# EAGLE design AdapterQFP48forZIF (EAGLE 6.3)
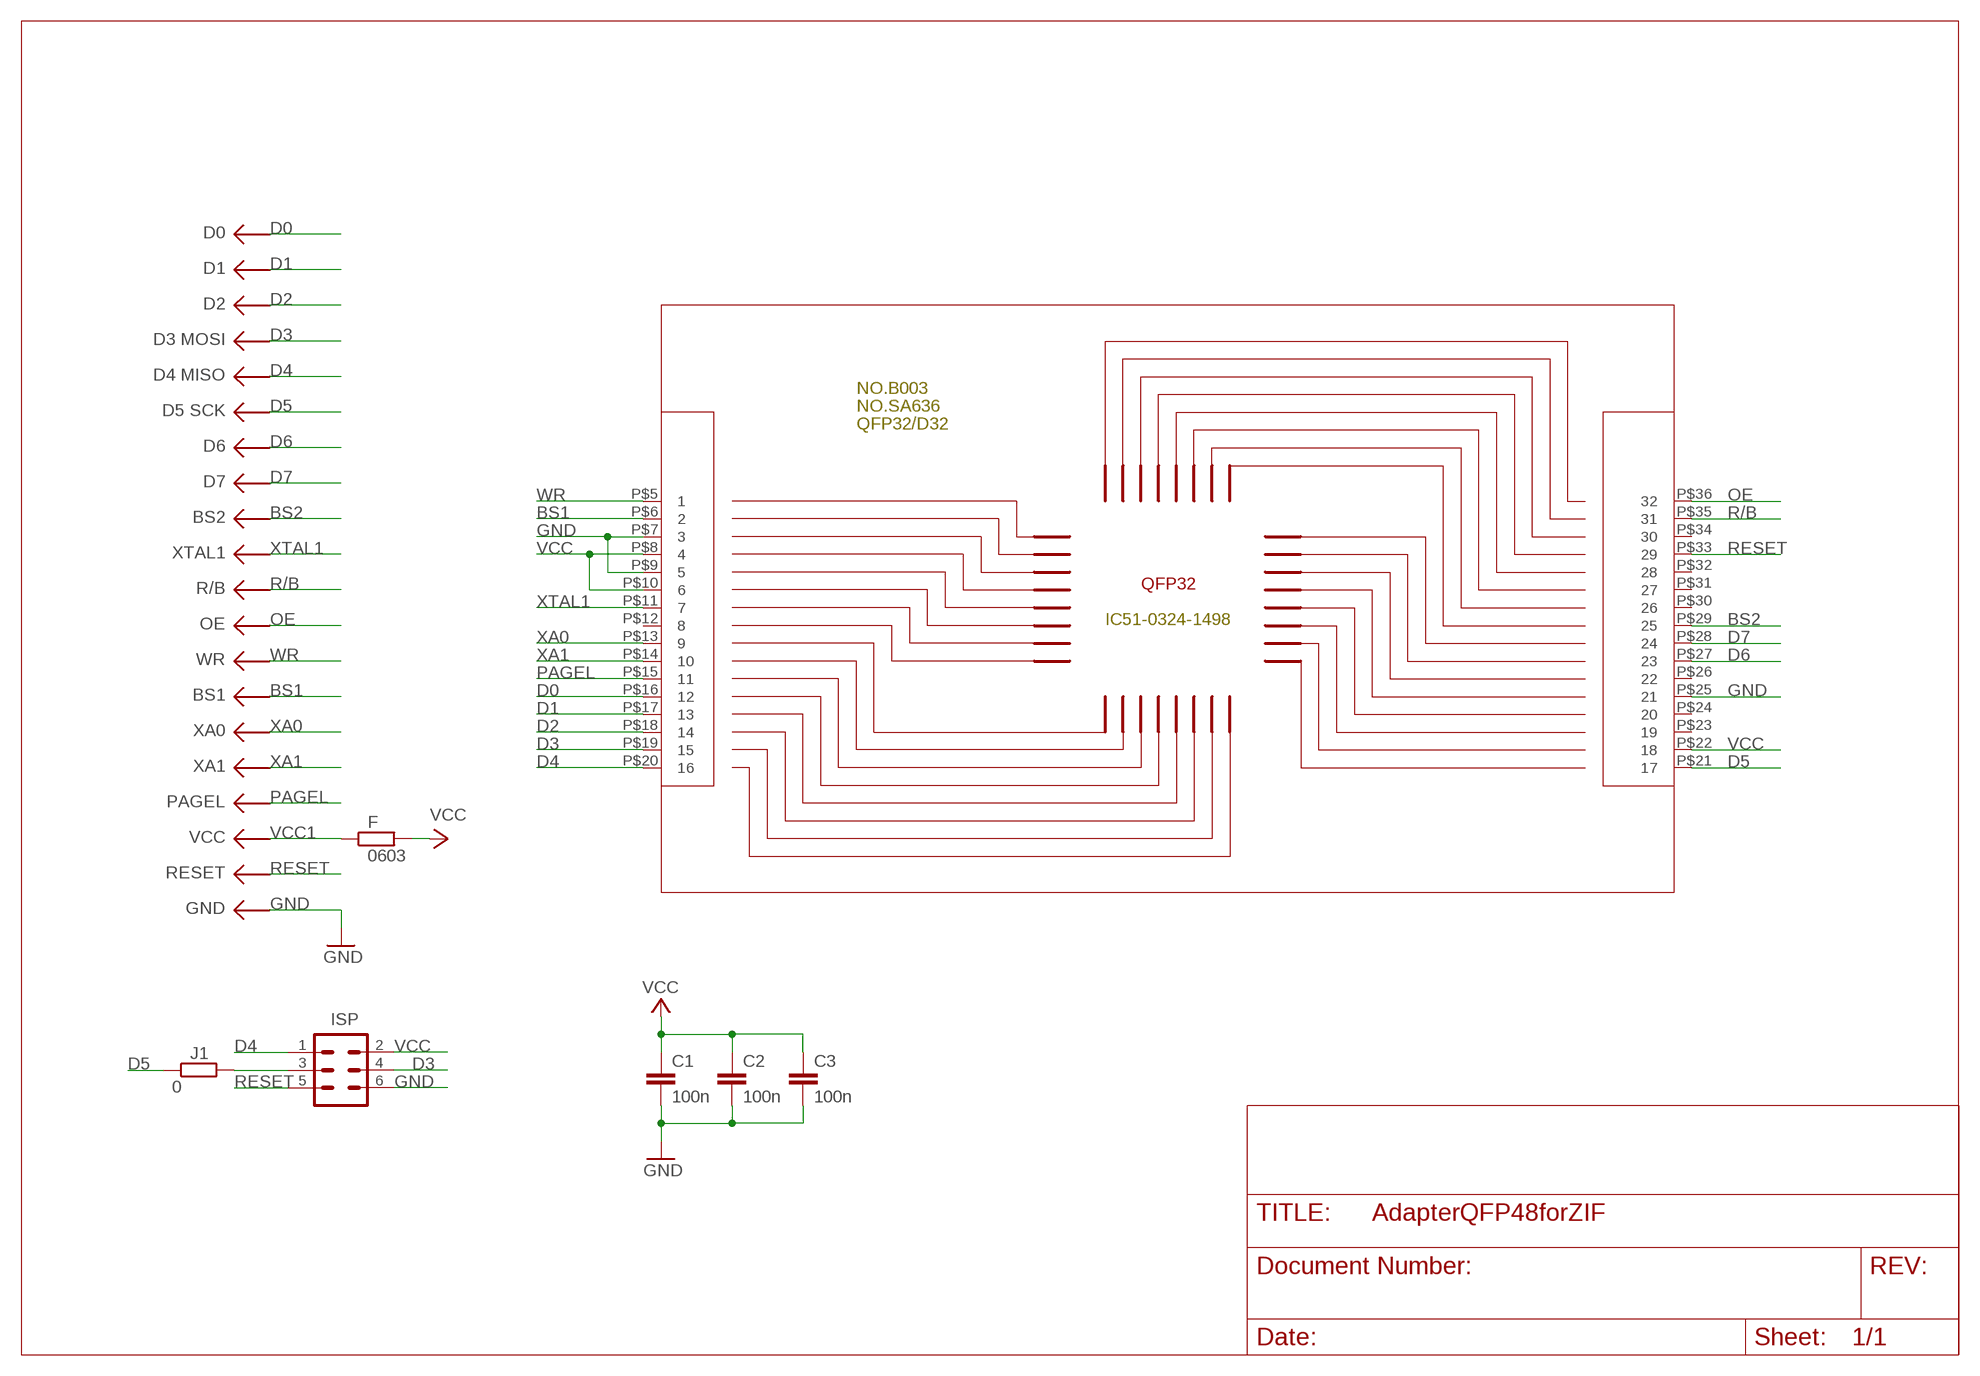
[diagram p0: schematic, sheet 1]

## Parts
C1  100n  RCL_C-EUC0805  [RCL_C0805]
C2  100n  RCL_C-EUC0805  [RCL_C0805]
C3  100n  RCL_C-EUC0805  [RCL_C0805]
F  0603  RCL_R-EU_M0805  [RCL_M0805]
ISP  MA03-2  [MA03-2]
J1  0  R-EU_R1206W  [R1206W]
U$1  PROGRAMMER_P_AVR  [PROGRAMMER_P_AVR]
U$14  SA636-40  [ADAPTERQFP48FORZIF]

## Nets
BS1: U$1.BS1 U$14.P$6
BS2: U$1.BS2 U$14.P$29
D0: U$1.D0 U$14.P$16
D1: U$1.D1 U$14.P$17
D2: U$1.D2 U$14.P$18
D3: ISP.4 U$1.D3 U$14.P$19
D4: ISP.1 U$1.D4 U$14.P$20
D5: J1.1 U$1.D5 U$14.P$21
D6: U$1.D6 U$14.P$27
D7: U$1.D7 U$14.P$28
GND: C1.2 C2.2 C3.2 ISP.6 U$1.GND U$1.GND01(GND) U$1.GND2(GND) U$1.GND03(GND) U$1.GND04(GND) U$1.GND05(GND) U$1.GND06(GND) U$1.GND07(GND) U$1.GND08(GND) U$1.GND09(GND) U$1.GND10(GND) U$1.GND11(GND) U$1.GND12(GND) U$1.GND13(GND) U$1.GND14(GND) U$1.GND15(GND) U$1.GND16(GND) U$1.GND17(GND) U$1.GND18(GND) U$1.GND19(GND) U$1.GND20(GND) U$1.GND21(GND) U$1.GND22(GND) U$14.P$7 U$14.P$9 U$14.P$25
N$6: ISP.3 J1.2
OE: U$1.OE U$14.P$36
PAGEL: U$1.PAGEL U$14.P$15
R/B: U$1.RB U$14.P$35
RESET: ISP.5 U$1.RESET U$14.P$33
VCC: C1.1 C2.1 C3.1 F.2 ISP.2 U$14.P$8 U$14.P$10 U$14.P$22
VCC1: F.1 U$1.VCC
WR: U$1.WR U$14.P$5
XA0: U$1.XA0 U$14.P$13
XA1: U$1.XA1 U$14.P$14
XTAL1: U$1.XTAL1 U$14.P$11
Unconnected: U$14.P$12 U$14.P$23 U$14.P$24 U$14.P$26 U$14.P$30 U$14.P$31 U$14.P$32 U$14.P$34

## Notes on the sheet
- NO.B003
- NO.SA636
- QFP32/D32
- IC51-0324-1498

## Library data of the parts
C1-C3 = HWProgUSB:RCL_C-EU: CAPACITOR, European symbol
F = HWProgUSB:RCL_R-EU_: RESISTOR, European symbol
ISP = con-lstb:MA03-2: PIN HEADER
J1 = rcl:R-EU_: RESISTOR, European symbol
U$1 = AdapterDIP_P:PROGRAMMER_P_AVR
U$14 = AdapterQFP48forZIF:SA636-40

## Board
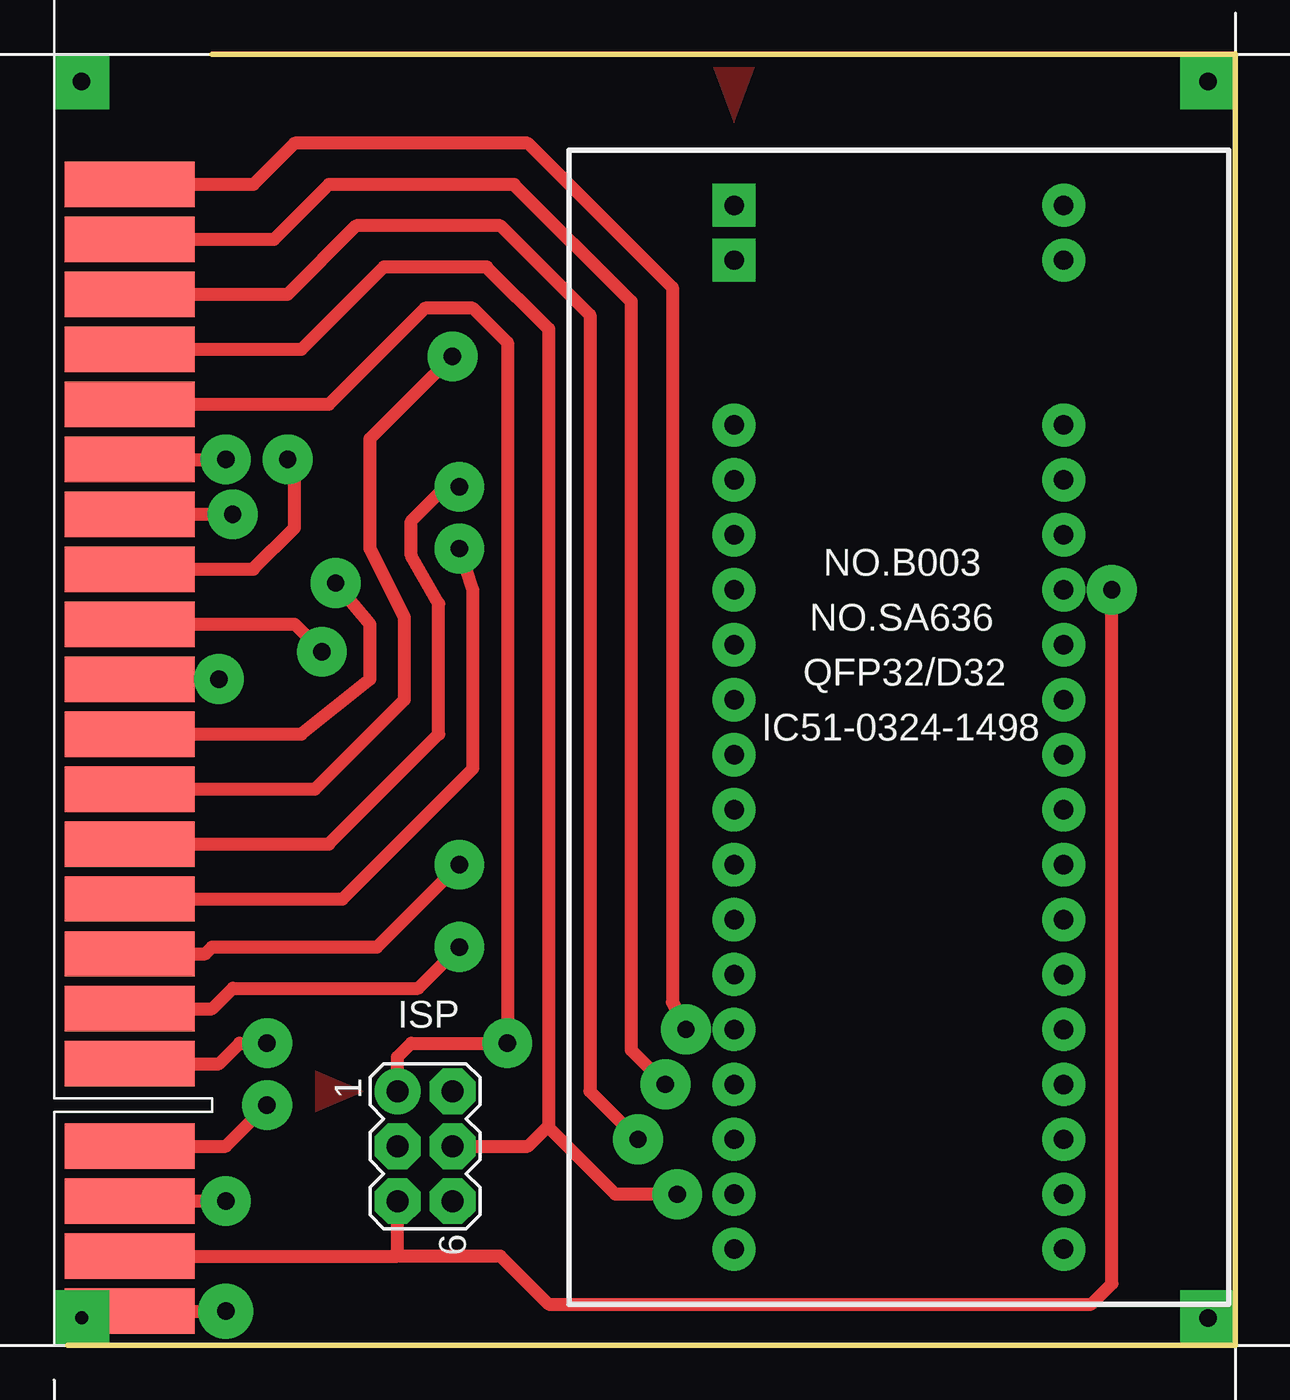
[diagram p1: board, top side]
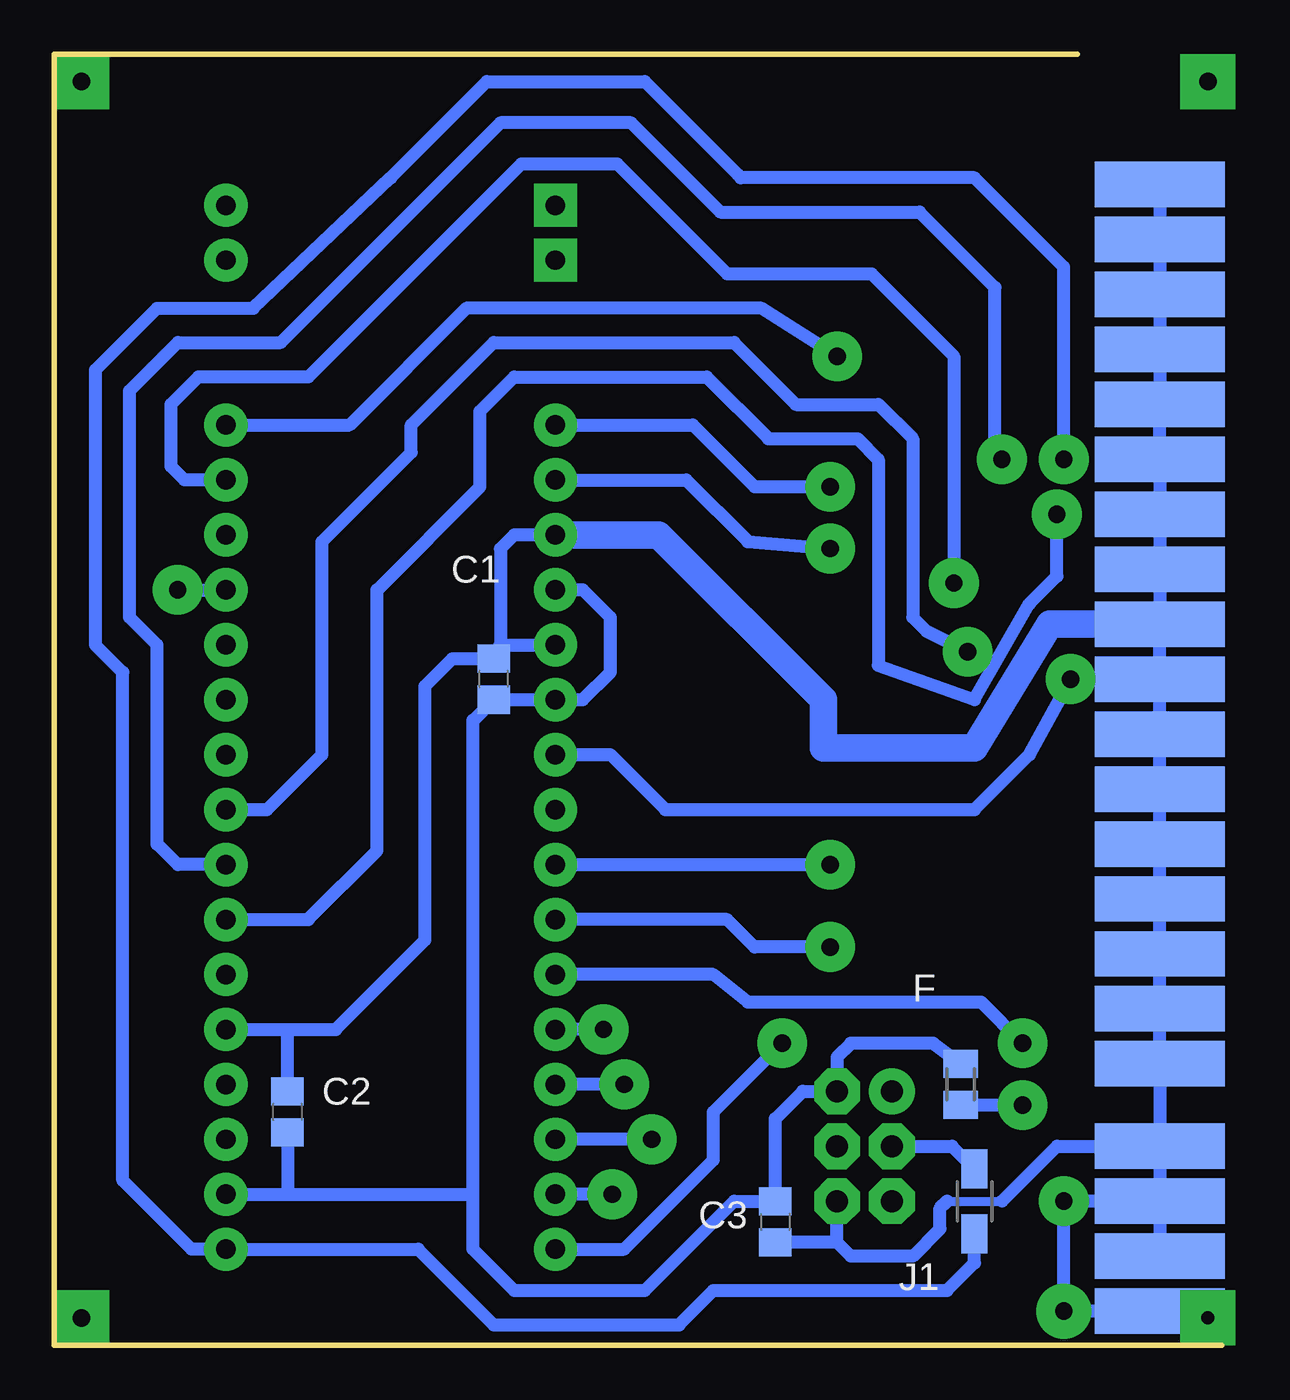
[diagram p2: board, bottom side, seen from below]

Size 53.98 x 59.69 mm. Coordinates in mm from the lower left corner, seen from the top.
Outline: 6.67,59.69 53.98,59.69 53.98,0 0,0
Copper layers (1*16): Top 0.035mm / dielectric 1.5mm / Bottom 0.035mm
Design rules "DesignRules": minimum track width 8mil, minimum drill 24mil, track to track 0.2mm, track to pad 0.2mm, pad to pad 8mil, via to via 8mil, smd to smd 8mil, copper to edge 10mil, drill to drill 8mil, minimum pad ring 0.55mm, minimum via ring 8mil, stop-mask expansion 4mil, vias tented up to drill 0mil, thermal gap 10mil

### Footprints (pad centres in the part's own frame; a part is rotated, then mirrored left to right if it is on the bottom)
RCL_C0805 = smd 1.3 x 1.5: 1 -0.95,0; 2 0.95,0
RCL_M0805 = smd 1.3 x 1.6: 1 -0.95,0; 2 0.95,0
MA03-2 = drill 1.016: 1 -2.54,-1.27 | drill 1.016 octagon: 2 -2.54,1.27; 3 0,-1.27; 4 0,1.27; 5 2.54,-1.27; 6 2.54,1.27
R1206W = smd 1.8 x 1.2: 1 -1.499,0; 2 1.499,0
PROGRAMMER_P_AVR = smd 2.1 x 6: BS1 37.782,-0.318; BS2 25.082,-0.318; D0 4.763,-0.318; D1 7.303,-0.318; D2 9.842,-0.318; D3 12.383,-0.318; D4 14.922,-0.318; D5 17.462,-0.318; D6 20.003,-0.318; D7 22.543,-0.318; GND 51.752,-0.318; GND2 56.833,-0.318; OE 32.703,-0.318; PAGEL 45.403,-0.318; RB 30.163,-0.318; RESET 54.292,-0.318; VCC 49.212,-0.318; WR 35.242,-0.318; XA0 40.322,-0.318; XA1 42.862,-0.318; XTAL1 27.622,-0.318 | smd 2.1 x 6 bottom: GND01 4.763,-0.318; GND03 7.303,-0.318; GND04 9.842,-0.318; GND05 12.383,-0.318; GND06 14.922,-0.318; GND07 17.462,-0.318; GND08 20.003,-0.318; GND09 22.543,-0.318; GND10 25.082,-0.318; GND11 27.622,-0.318; GND12 30.163,-0.318; GND13 32.703,-0.318; GND14 35.242,-0.318; GND15 37.782,-0.318; GND16 40.322,-0.318; GND17 42.862,-0.318; GND18 45.403,-0.318; GND19 49.212,-0.318; GND20 51.752,-0.318; GND21 54.292,-0.318; GND22 56.833,-0.318
ADAPTERQFP48FORZIF = drill 0.9 square: P$1 -7.62,22.86; P$2 -7.62,20.32 | drill 0.9: P$5 -7.62,12.7; P$6 -7.62,10.16; P$7 -7.62,7.62; P$8 -7.62,5.08; P$9 -7.62,2.54; P$10 -7.62,0; P$11 -7.62,-2.54; P$12 -7.62,-5.08; P$13 -7.62,-7.62; P$14 -7.62,-10.16; P$15 -7.62,-12.7; P$16 -7.62,-15.24; P$17 -7.62,-17.78; P$18 -7.62,-20.32; P$19 -7.62,-22.86; P$20 -7.62,-25.4; P$21 7.62,-25.4; P$22 7.62,-22.86; P$23 7.62,-20.32; P$24 7.62,-17.78; P$25 7.62,-15.24; P$26 7.62,-12.7; P$27 7.62,-10.16; P$28 7.62,-7.62; P$29 7.62,-5.08; P$30 7.62,-2.54; P$31 7.62,0; P$32 7.62,2.54; P$33 7.62,5.08; P$34 7.62,7.62; P$35 7.62,10.16; P$36 7.62,12.7; P$39 7.62,20.32; P$40 7.62,22.86

### Placement (x,y rotation side)
C1  33.66,30.8 90 bottom
C2  43.18,10.8 90 bottom
C3  20.64,5.71 270 bottom
F  12.07,12.07 90 bottom
ISP  16.51,9.21 270 top
J1  11.43,6.67 90 bottom
U$1  3.18,58.42 270 top
U$14  38.42,29.85 0 top

### Tracks (layer width: path | path; a pad name or v marks a point on that pad's centre or on a via)
BS1  (via drill 0.8 pad 2.3)
  Top 0.61: U$1.BS1 12.7,20.64 18.73,26.67 18.73,34.93 v18.1,36.83
  Bottom 0.61: U$14.P$6 24.77,40 21.91,37.15 v18.1,36.83
BS2  (via drill 0.8 pad 2.3)
  Top 0.61: U$1.BS2 10.48,33.34 v11.75,32.07
  Bottom 0.61: U$14.P$29 44.13,24.76 41.59,27.31 41.59,37.15 37.47,41.28 37.47,42.54 33.66,46.35 22.54,46.35 19.68,43.5 15.88,43.5 14.29,41.91 14.29,33.65 13.65,33.02 v11.75,32.07
D0  (via drill 0.8 pad 2.3)
  Top 0.61: v28.58,14.6 27.94,15.87 27.94,48.89 21.27,55.56 10.48,55.56 8.57,53.66 U$1.D0
  Bottom 0.61: v28.58,14.6 U$14.P$16
D1  (via drill 0.8 pad 2.3)
  Top 0.61: v27.62,12.07 26.04,13.65 26.04,48.26 20.64,53.66 12.07,53.66 9.52,51.12 U$1.D1
  Bottom 0.61: v27.62,12.07 U$14.P$17
D2  (via drill 0.8 pad 2.3)
  Top 0.61: v26.35,9.53 24.13,11.75 24.13,47.63 20,51.75 13.34,51.75 10.16,48.58 U$1.D2
  Bottom 0.61: v26.35,9.53 U$14.P$18
D3  (via drill 0.8 pad 2.3)
  Top 0.61: 22.23,10.16 22.23,46.99 19.37,49.85 14.61,49.85 10.8,46.04 U$1.D3 | 22.23,10.16 22.23,10.07 25.31,6.98 v28.17,6.98 | ISP.4 21.27,9.21 22.23,10.16
  Bottom 0.61: v28.17,6.98 U$14.P$19
D4  (via drill 0.8 pad 2.3)
  Top 0.61: U$1.D4 12.07,43.5 16.51,47.94 18.73,47.94 20.32,46.35 v20.32,13.97 15.88,13.97 15.24,13.34 ISP.1
  Bottom 0.61: U$14.P$20 27.62,4.44 23.49,8.57 23.49,10.8 v20.32,13.97
D5  (via drill 0.8 pad 2.3)
  Top 0.61: U$1.D5 v7.3,40.96
  Bottom 0.61: J1.1 11.43,3.81 12.7,2.54 23.49,2.54 25.08,0.95 33.66,0.95 37.15,4.44 U$14.P$21 47.62,4.44 50.8,7.62 50.8,31.11 52.07,32.39 52.07,45.08 49.21,47.94 44.77,47.94 38.42,53.97 33.97,58.42 26.67,58.42 22.38,54.13 22.23,53.97 11.43,53.97 7.3,49.85 v7.3,40.96
D6  (via drill 0.8 pad 2.3)
  Top 0.61: U$1.D6 v7.62,38.42
  Bottom 0.61: U$14.P$27 42.23,19.68 39.05,22.86 39.05,34.93 34.29,39.69 34.29,43.18 32.7,44.77 23.81,44.77 20.95,41.91 16.83,41.91 15.88,40.96 15.88,31.43 11.43,29.85 8.89,34.29 7.62,35.56 v7.62,38.42
D7  (via drill 0.8 pad 2.3)
  Top 0.61: U$1.D7 8.57,35.88 10.48,37.78 10.48,40.64 v10.16,40.96
  Bottom 0.61: U$14.P$28 48.26,22.23 49.21,23.18 49.21,32.39 50.48,33.65 50.48,44.13 48.26,46.35 43.5,46.35 33.34,56.51 27.3,56.51 23.18,52.39 13.97,52.39 10.48,48.89 10.48,41.28 v10.16,40.96
GND  (via drill 0.8 pad 2.3, 0.8 pad 2.54)
  Top 0.61: v7.3,6.67 U$1.GND | U$1.GND22 v7.3,1.59
  Bottom 0.406: 12.7,6.67 10.16,6.67
  Bottom 0.61: U$1.GND01 U$1.GND03 U$1.GND04 U$1.GND05 U$1.GND06 U$1.GND07 U$1.GND08 U$1.GND09 U$1.GND10 U$1.GND11 U$1.GND12 U$1.GND13 U$1.GND14 U$1.GND15 U$1.GND16 U$1.GND17 U$1.GND18 U$1.GND19 | 33.34,32.39 U$14.P$9 | U$14.P$7 32.7,37.46 33.34,36.83 33.34,32.39 | U$14.P$25 43.18,14.6 | 43.18,14.6 40.96,14.6 36.83,18.73 36.83,30.48 35.56,31.75 C1.2 33.34,32.39 | U$1.GND19 7.62,9.21 10.16,6.67 | U$1.GND v7.3,6.67 v7.3,1.59 U$1.GND22 | U$1.GND19 U$1.GND | U$1.GND U$1.GND21 | 17.78,4.76 17.14,4.13 14.29,4.13 13.02,5.4 13.02,6.35 12.7,6.67 | 17.78,4.76 ISP.6 | C2.2 43.18,14.6 | 17.78,4.76 C3.2
  Bottom 1.27: U$14.P$7 26.04,37.46 18.41,29.85 18.41,27.62 11.43,27.62 7.94,33.34 U$1.GND10
N$1  (via drill 0.8 pad 2.54)
  other vias: 0.63,58.42
N$2  (via drill 0.8 pad 2.54)
  other vias: 52.71,58.42
N$3  (via drill 0.8 pad 2.54)
  other vias: 52.71,1.27
N$4  (via drill 0.6 pad 2.54)
  other vias: 0.63,1.27
N$5
  pour Top: 13.65,11.75 11.43,12.7 11.43,10.8
N$6
  Bottom 0.61: ISP.3 12.47,9.21 J1.2
N$7
  pour Top: 30.8,56.52 31.75,59.06 29.84,59.06
OE  (via drill 0.8 pad 2.3)
  Top 0.61: U$1.OE 11.43,25.72 15.56,29.85 15.56,33.65 13.97,36.83 13.97,41.91 v17.78,45.72
  Bottom 0.61: v17.78,45.72 21.27,47.94 34.92,47.94 40.32,42.54 U$14.P$36
PAGEL  (via drill 0.8 pad 2.3)
  Top 0.61: U$1.PAGEL 6.98,13.02 7.94,13.97 v9.21,13.97
  Bottom 0.61: U$14.P$15 23.49,17.14 21.91,15.87 11.11,15.87 v9.21,13.97
R/B  (via drill 0.8 pad 2.3)
  Top 0.61: U$1.RB 10.8,28.26 13.97,30.8 13.97,33.34 v12.38,35.24
  Bottom 0.61: U$14.P$35 47.94,40 48.58,40.64 48.58,43.5 47.31,44.77 42.23,44.77 32.38,54.61 27.94,54.61 22.86,49.53 16.19,49.53 12.38,45.72 v12.38,35.24
RESET  (via drill 0.8 pad 2.3)
  Top 0.61: U$1.RESET 15.24,4.13 | v48.26,34.93 48.26,2.86 47.31,1.91 22.23,1.91 20,4.13 15.24,4.13 | 15.24,4.13 ISP.5
  Bottom 0.61: v48.26,34.93 U$14.P$33
VCC
  Bottom 0.61: U$14.P$22 43.18,6.98 | 43.18,6.98 34.61,6.98 | 34.61,6.98 34.61,28.89 C1.1 32.7,29.85 U$14.P$10 29.53,29.85 28.26,31.11 28.26,33.65 29.53,34.93 U$14.P$8 | 34.61,6.98 34.61,4.44 32.7,2.54 26.67,2.54 22.55,6.67 C3.1 20.64,10.48 19.37,11.75 ISP.2 17.78,13.34 17.14,13.97 13.97,13.97 13.33,13.97 F.2 | C2.1 43.18,6.98
VCC1  (via drill 0.8 pad 2.3)
  Top 0.61: U$1.VCC 2.86,8.89 3.18,8.89 3.18,9.21 7.3,9.21 v9.21,11.11
  Bottom 0.61: F.1 v9.21,11.11
WR  (via drill 0.8 pad 2.3)
  Top 0.61: U$1.WR 12.07,23.18 17.14,28.26 17.14,34.29 15.88,36.51 15.88,38.1 17.14,39.37 v18.1,39.69
  Bottom 0.61: U$14.P$5 24.45,42.54 21.59,39.69 v18.1,39.69
XA0  (via drill 0.8 pad 2.3)
  Top 0.61: v18.1,22.23 14.29,18.41 6.67,18.41 6.35,18.1 U$1.XA0
  Bottom 0.61: U$14.P$13 v18.1,22.23
XA1  (via drill 0.8 pad 2.3)
  Top 0.61: U$1.XA1 6.67,15.56 7.62,16.51 16.19,16.51 v18.1,18.41
  Bottom 0.61: v18.1,18.41 21.59,18.41 22.86,19.68 U$14.P$14
XTAL1  (via drill 0.8 pad 2.3)
  Top 0.61: v6.98,30.8 U$1.XTAL1
  Bottom 0.61: v6.98,30.8 8.89,27.31 11.43,24.76 25.72,24.76 28.26,27.31 U$14.P$11